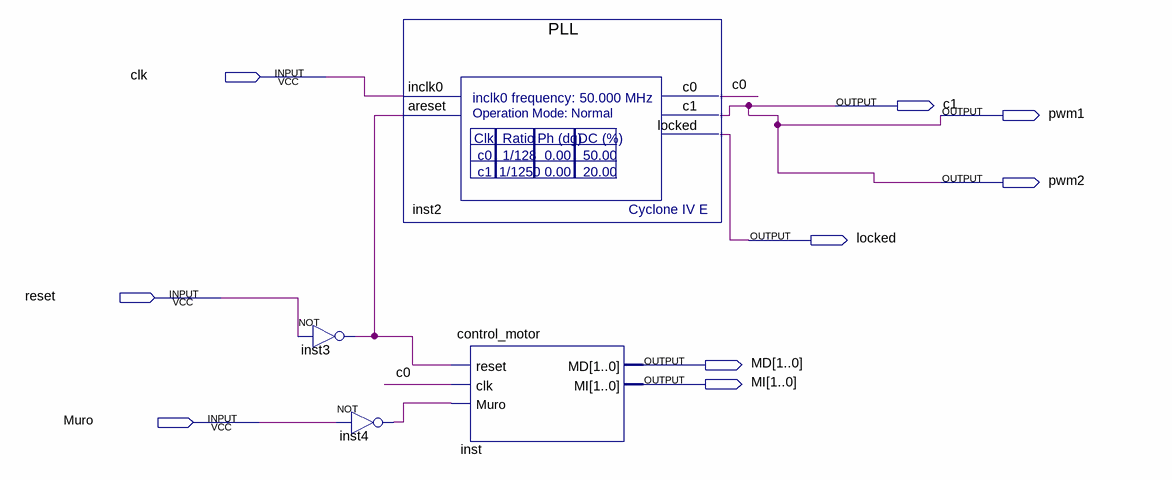
[diagram p0: schematic sheet]
// Quartus schematic Prueba_giros.bdf as structural Verilog: 4 symbols, 9 pins
module Prueba_giros (
  input  clk,
  input  reset,
  input  Muro,
  output c1,
  output pwm1,
  output pwm2,
  output locked,
  output [1:0] MD,
  output [1:0] MI
);

  wire c0, inst3_out, inst4_out;

  not inst3 (inst3_out, reset);
  not inst4 (inst4_out, Muro);
  PLL inst2 (.inclk0(clk), .areset(inst3_out), .c0(c0), .c1(c1), .locked(locked));
  control_motor inst (.reset(inst3_out), .clk(c0), .Muro(inst4_out), .MD(MD), .MI(MI));

  assign pwm1 = c1;
  assign pwm2 = c1;
endmodule
